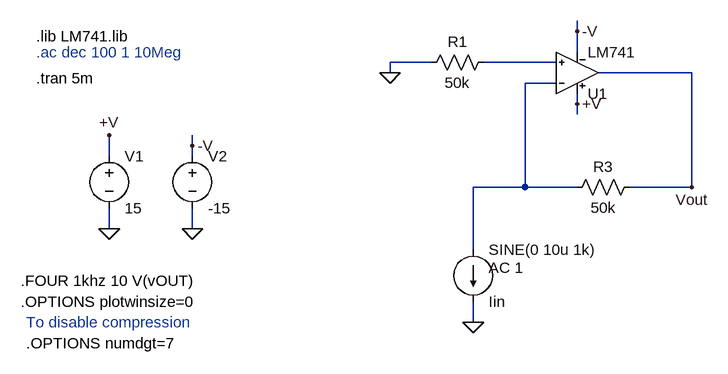
[diagram p0: schematic A_IV_single_ended.asc]
A_IV_single_ended.asc, the LTspice schematic file:
Version 4
SHEET 1 1012 980
WIRE -32 192 -32 176
WIRE -32 224 -32 192
WIRE -256 240 -320 240
WIRE -64 240 -176 240
WIRE -320 256 -320 240
WIRE 144 256 0 256
WIRE -64 272 -112 272
WIRE -32 304 -32 288
WIRE -32 320 -32 304
WIRE -624 368 -624 352
WIRE -752 384 -752 352
WIRE -624 384 -624 368
WIRE -112 432 -112 272
WIRE -112 432 -192 432
WIRE -32 432 -112 432
WIRE 144 432 144 256
WIRE 144 432 48 432
WIRE -752 496 -752 464
WIRE -624 496 -624 464
WIRE -192 528 -192 432
WIRE -192 640 -192 608
FLAG -752 496 0
FLAG -624 496 0
FLAG 144 432 Vout
FLAG -752 352 +V
FLAG -624 368 -V
FLAG -32 304 +V
FLAG -32 192 -V
FLAG -320 256 0
FLAG -192 640 0
DATAFLAG 144 336 ""
SYMBOL voltage -752 368 R0
WINDOW 123 0 0 Left 2
WINDOW 39 0 0 Left 2
SYMATTR InstName V1
SYMATTR Value 15
SYMBOL voltage -624 368 R0
WINDOW 123 0 0 Left 2
WINDOW 39 0 0 Left 2
SYMATTR InstName V2
SYMATTR Value -15
SYMBOL res 64 416 R90
WINDOW 0 0 56 VBottom 2
WINDOW 3 32 56 VTop 2
SYMATTR InstName R3
SYMATTR Value 50k
SYMBOL current -192 528 R0
WINDOW 0 24 80 Left 2
WINDOW 3 24 0 Left 2
WINDOW 123 24 28 Left 2
WINDOW 39 0 0 Left 0
SYMATTR InstName Iin
SYMATTR Value SINE(0 10u 1k)
SYMATTR Value2 AC 1
SYMBOL LM741 -32 320 M180
SYMATTR InstName U1
SYMBOL res -160 224 R90
WINDOW 0 0 56 VBottom 2
WINDOW 3 32 56 VTop 2
SYMATTR InstName R1
SYMATTR Value 50k
TEXT -864 200 Left 2 !.lib LM741.lib
TEXT -864 224 Left 2 ;.ac dec 100 1 10Meg
TEXT -888 576 Left 2 !.FOUR 1khz 10 V(vOUT)
TEXT -888 608 Left 2 !.OPTIONS plotwinsize=0
TEXT -880 640 Left 2 ;To disable compression
TEXT -880 672 Left 2 !.OPTIONS numdgt=7
TEXT -864 264 Left 2 !.tran 5m

The netlist it stands for:
* A_IV_single_ended.asc
V1 +V 0 15
V2 -V 0 -15
R3 Vout N002 50k
Iin N002 0 SINE(0 10u 1k) AC 1
XU1 N001 N002 +V -V Vout LM741  ; pins In+ In- V+ V- OUT
R1 N001 0 50k
.lib LM741.lib
* .ac dec 100 1 10Meg
.FOUR 1khz 10 V(vOUT)
.OPTIONS plotwinsize=0
* To disable compression
.OPTIONS numdgt=7
.tran 5m
.lib LM741.lib
.backanno
.end